# Altium schematic sheet Curiosity_Nano_Base_for_Clicks_TopLevel.SchDoc: Top Level
size A3; Organization: Microchip Technology Norway; Address1: Brøsetvegen 164; Address2: 7069 Trondheim; Address3: NORWAY; SheetNumber: 1; SheetTotal: 3; DrawnBy: T.Frostad; Engineer: T.Frostad; PageSetup: Record=PageOptions|CenterHorizontal=True|CenterVertical=True|PrintScale=1.01|XCorrection=1.00|YCorrection=1.00|PrintKind=1|BorderSize=5000000|LeftOffset=0|BottomOffset=0|Orientation=2|PaperLength=1000|PaperWidth=1000|Scale=100|PaperSource=7|PrintQuality=-4|MediaType=1|DitherType=10|PaperKind=A3 (297 x 420 mm)|PrintScaleMode=1; ProjectTitle: Curiosity Nano Base for Click boards; ProjectName: ATmega4809 Curiosity Nano
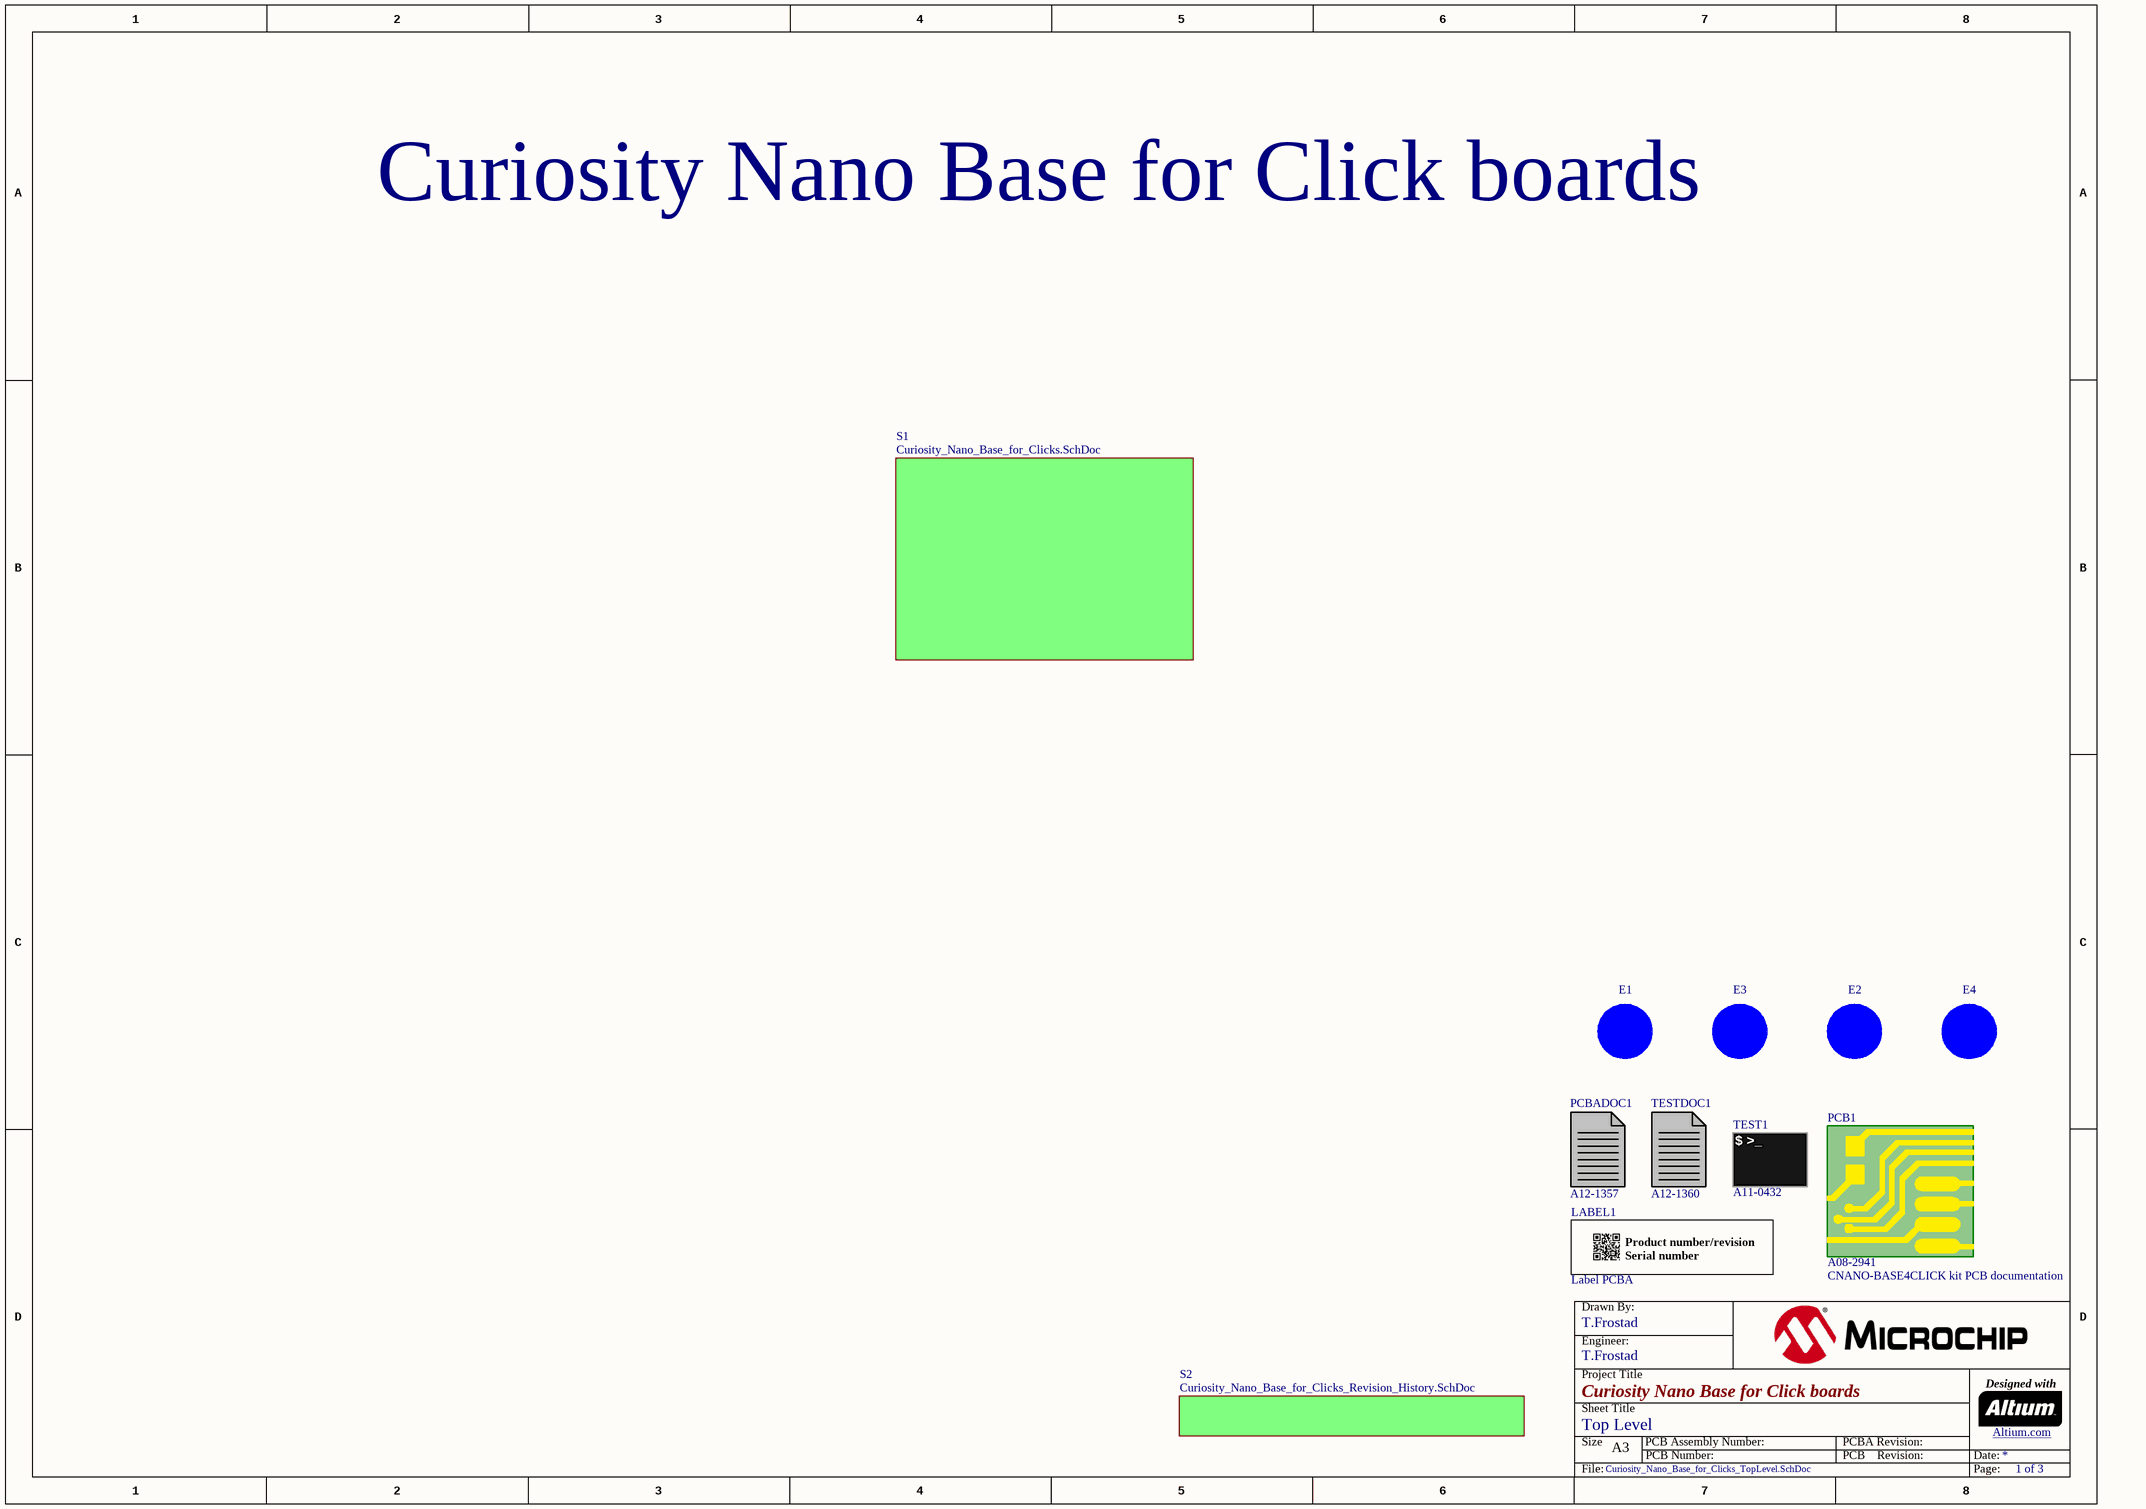
[diagram p0: Curiosity_Nano_Base_for_Clicks_TopLevel.SchDoc]

## Parts
E1  (no value)  [AP8-00192]
E2  (no value)  [AP8-00192]
E3  (no value)  [AP8-00192]
E4  (no value)  [AP8-00192]
LABEL1  value Label PCBA  [AP8-00317]
PCB1  value CNANO-BASE4CLICK kit PCB documentation  AN: A08-2941  (mechanical)
PCBADOC1  AN: A12-1357  (mechanical)
TEST1  AN: A11-0432  (mechanical)
TESTDOC1  AN: A12-1360  (mechanical)

## Sub-sheets
S1 = Curiosity_Nano_Base_for_Clicks.SchDoc: no entries
S2 = Curiosity_Nano_Base_for_Clicks_Revision_History.SchDoc: no entries

## Nets

Not connected (* = marked no-connect by the designer): E1 1(FIDUCIAL); E2 1(FIDUCIAL); E3 1(FIDUCIAL); E4 1(FIDUCIAL)

## Notes on the sheet
- Curiosity Nano Base for Click boards
- Drawn By:
- Project Title
- Engineer:
- Designed with
- Sheet Title
- Size
- A3
- PCB Number:
- PCB Assembly Number:
- PCBA Revision:
- PCB    Revision:
- Date:
- Altium.com <http://go.altium.com/MicrochipLandingPage_Evaluation.html>
- File:
- Page:
- (in symbol A09-0611) / Product number/revision / Serial number
- (in symbol A11-0432) $ >_

## Library data of the parts
E1-E4 = A08-0053: 2.8mm adhesive feet,diam 8.0mm; PartGroup: Mechanical devices,Mounting accessories; Manufacturer: 3M; Value: SJ-5076; AN: A08-0053; Height: 2.79999995231628; MPN: SJ-5076
LABEL1 = A09-0611: PCBA identification label PP Top White Gloss; PartGroup: Mechanical devices,Packaging materials,Printed Labels,PCBA; Manufacturer: ACT Logimark AS; MPN: 505462; AN: A09-0611
PCB1 = A08-2941: CNANO-BASE4CLICK kit PCB documentation; PartGroup: Mechanical devices,Printed circuit boards
PCBADOC1 = A12-1357: Curiosity Nano BASE4CLICK PCBA documentation; PartGroup: Documentation,PCBA Documents,Atmel; Value: A09-3206 PCBA Files
TEST1 = A11-0432: Fixture test for Curiosity Nano Base for Click Boards; PartGroup: Software,Test software,Starter Kit; Value: Curiosity Nano BASE4CLICK test
TESTDOC1 = A12-1360: Test instructions for the Curiosity Nano Base for Click Boards; PartGroup: Documentation,Procedures,Test Instructions; Value: CNANO-BASE4CLICK test instructions